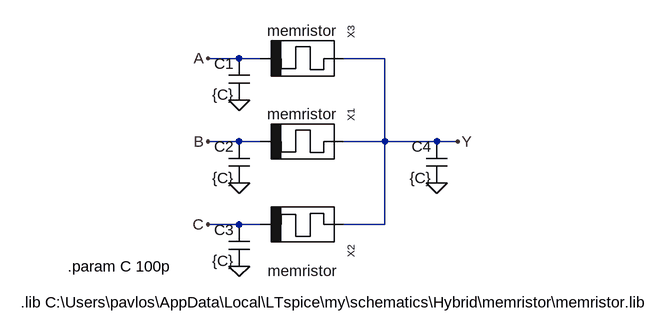
[diagram p0: schematic and3.asc]
and3.asc, the LTspice schematic file:
Version 4
SHEET 1 880 680
WIRE -336 -576 -384 -576
WIRE -304 -576 -336 -576
WIRE -112 -576 -176 -576
WIRE -336 -448 -384 -448
WIRE -304 -448 -336 -448
WIRE -112 -448 -112 -576
WIRE -112 -448 -176 -448
WIRE -32 -448 -112 -448
WIRE 0 -448 -32 -448
WIRE -336 -320 -384 -320
WIRE -304 -320 -336 -320
WIRE -112 -320 -112 -448
WIRE -112 -320 -176 -320
FLAG 0 -448 Y
FLAG -384 -448 B
FLAG -384 -320 C
FLAG -32 -384 0
FLAG -336 -384 0
FLAG -336 -256 0
FLAG -384 -576 A
FLAG -336 -512 0
SYMBOL cap -16 -448 M0
SYMATTR InstName C4
SYMATTR Value {C}
SYMBOL memristor -240 -448 M270
WINDOW 3 58 -1 VBottom 2
WINDOW 39 79 -4 VBottom 2
SYMATTR InstName X1
SYMBOL memristor -240 -320 R90
WINDOW 3 56 -2 VTop 2
WINDOW 39 82 4 VTop 2
SYMATTR InstName X2
SYMBOL cap -320 -448 M0
SYMATTR InstName C2
SYMATTR Value {C}
SYMBOL cap -320 -320 M0
SYMATTR InstName C3
SYMATTR Value {C}
SYMBOL memristor -240 -576 M270
WINDOW 3 58 -1 VBottom 2
WINDOW 39 79 -4 VBottom 2
SYMATTR InstName X3
SYMBOL cap -320 -576 M0
SYMATTR InstName C1
SYMATTR Value {C}
TEXT -672 -200 Left 2 !.lib C:\\Users\\pavlos\\AppData\\Local\\LTspice\\my\\schematics\\Hybrid\\memristor\\memristor.lib
TEXT -600 -256 Left 2 !.param C 100p

The netlist it stands for:
* and3.asc
C4 Y 0 {C}
XX1 Y B memristor  ; pins plus minus
XX2 Y C memristor  ; pins plus minus
C2 B 0 {C}
C3 C 0 {C}
XX3 Y A memristor  ; pins plus minus
C1 A 0 {C}
.lib C:\Users\pavlos\AppData\Local\LTspice\my\schematics\Hybrid\memristor\memristor.lib
.param C 100p
.backanno
.end